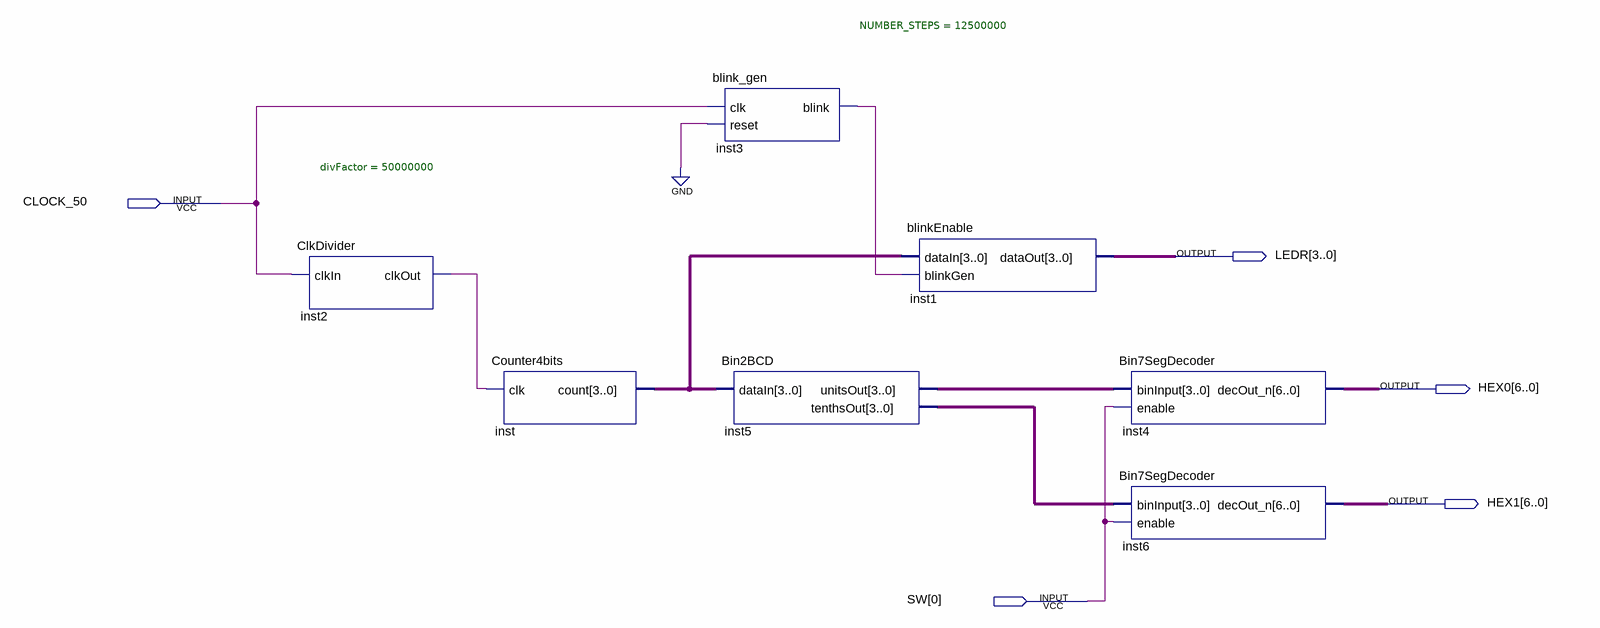
[diagram p0: schematic sheet]
// Quartus schematic Counter_Demo.bdf as structural Verilog: 7 symbols, 5 pins
module Counter_Demo (
  input  CLOCK_50,
  input  [0:0] SW,
  output [3:0] LEDR,
  output [6:0] HEX0,
  output [6:0] HEX1
);

  wire inst2_clkout, inst3_blink;
  wire [3:0] inst5_tenthsout, inst5_unitsout, inst_count;

  ClkDivider #(.divFactor(50000000)) inst2 (.clkIn(CLOCK_50), .clkOut(inst2_clkout));
  Counter4bits inst (.clk(inst2_clkout), .count(inst_count));
  blink_gen #(.NUMBER_STEPS(12500000)) inst3 (.clk(CLOCK_50), .reset(1'b0), .blink(inst3_blink));
  Bin2BCD inst5 (.dataIn(inst_count), .unitsOut(inst5_unitsout), .tenthsOut(inst5_tenthsout));
  blinkEnable inst1 (.dataIn(inst_count), .blinkGen(inst3_blink), .dataOut(LEDR));
  Bin7SegDecoder inst4 (.binInput(inst5_unitsout), .enable(SW[0]), .decOut_n(HEX0));
  Bin7SegDecoder inst6 (.binInput(inst5_tenthsout), .enable(SW[0]), .decOut_n(HEX1));
endmodule
